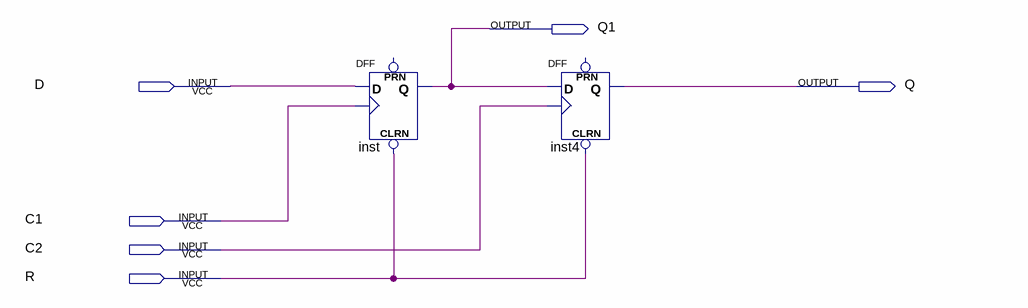
[diagram p0: schematic sheet]
// Quartus schematic 2-stroke_D-trigger.bdf as structural Verilog: 2 symbols, 6 pins
module \2-stroke_D-trigger  (
  input  D,
  input  C1,
  input  C2,
  input  R,
  output Q1,
  output Q
);

  DFF inst (.CLRN(R), .CLK(C1), .D(D), .Q(Q1));  // open: PRN
  DFF inst4 (.CLRN(R), .CLK(C2), .D(Q1), .Q(Q));  // open: PRN
endmodule
